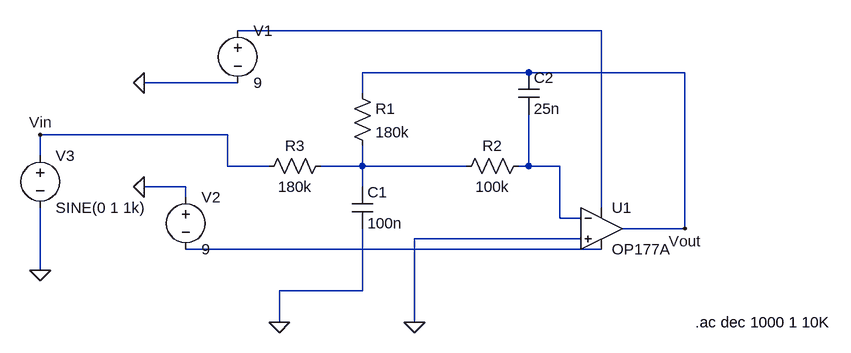
[diagram p0: schematic 31Hz-Low-Pass.asc]
31Hz-Low-Pass.asc, the LTspice schematic file:
Version 4
SHEET 1 880 680
WIRE 384 96 -176 96
WIRE 272 160 16 160
WIRE 512 160 272 160
WIRE -176 176 -320 176
WIRE 16 192 16 160
WIRE -192 256 -480 256
WIRE -480 288 -480 256
WIRE -192 304 -192 256
WIRE -128 304 -192 304
WIRE 16 304 16 272
WIRE 16 304 -48 304
WIRE 176 304 16 304
WIRE 272 304 272 224
WIRE 272 304 256 304
WIRE 320 304 272 304
WIRE -256 336 -320 336
WIRE 16 336 16 304
WIRE -256 352 -256 336
WIRE 384 368 384 96
WIRE 320 384 320 304
WIRE 352 384 320 384
WIRE 512 400 512 160
WIRE 512 400 416 400
WIRE 352 416 96 416
WIRE 384 432 -256 432
WIRE -480 464 -480 368
WIRE 16 496 16 400
WIRE 16 496 -112 496
WIRE -112 544 -112 496
WIRE 96 544 96 416
FLAG 96 544 0
FLAG -112 544 0
FLAG -320 336 0
FLAG -320 176 0
FLAG -480 464 0
FLAG 512 400 Vout
FLAG -480 256 Vin
SYMBOL OpAmps/OP177A 384 336 R0
SYMATTR InstName U1
SYMBOL voltage -176 80 R0
SYMATTR InstName V1
SYMATTR Value 9
SYMBOL voltage -256 336 R0
SYMATTR InstName V2
SYMATTR Value 9
SYMBOL Res 0 176 R0
SYMATTR InstName R1
SYMATTR Value 180k
SYMBOL Res 272 288 R90
WINDOW 0 0 56 VBottom 2
WINDOW 3 32 56 VTop 2
SYMATTR InstName R2
SYMATTR Value 100k
SYMBOL Res -32 288 R90
WINDOW 0 0 56 VBottom 2
WINDOW 3 32 56 VTop 2
SYMATTR InstName R3
SYMATTR Value 180k
SYMBOL cap 0 336 R0
SYMATTR InstName C1
SYMATTR Value 100n
SYMBOL cap 256 160 R0
SYMATTR InstName C2
SYMATTR Value 25n
SYMBOL voltage -480 272 R0
SYMATTR InstName V3
SYMATTR Value SINE(0 1 1k)
SYMATTR Value2 AC 1
TEXT 528 544 Left 2 !.ac dec 1000 1 10K

The netlist it stands for:
* 31Hz-Low-Pass.asc
XU1 0 N003 N001 N004 Vout OP177A  ; pins In+ In- V+ V- OUT
V1 N001 0 9
V2 0 N004 9
R1 Vout N002 180k
R2 N003 N002 100k
R3 N002 Vin 180k
C1 N002 0 100n
C2 Vout N003 25n
V3 Vin 0 SINE(0 1 1k) AC 1
.ac dec 1000 1 10K
.backanno
.end